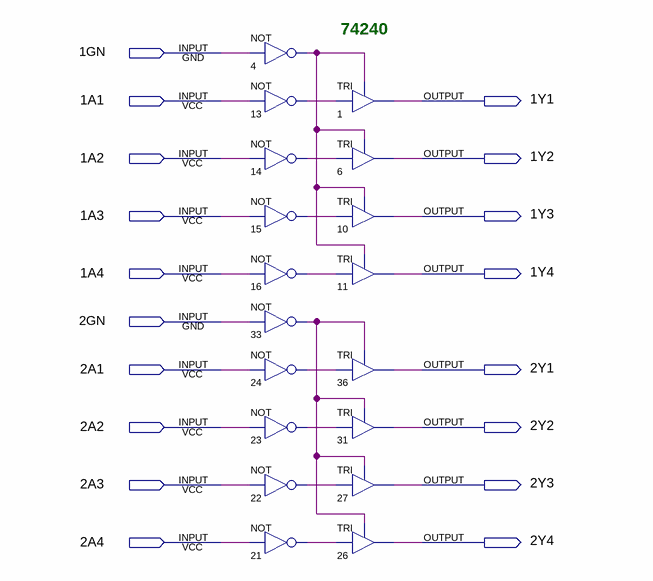
[diagram p0: schematic sheet]
// Quartus schematic 74240.bdf as structural Verilog: 18 symbols, 18 pins
module \74240  (
  input  \1GN ,
  input  \1A1 ,
  input  \1A2 ,
  input  \1A3 ,
  input  \1A4 ,
  input  \2GN ,
  input  \2A1 ,
  input  \2A2 ,
  input  \2A3 ,
  input  \2A4 ,
  output \1Y1 ,
  output \1Y2 ,
  output \1Y3 ,
  output \1Y4 ,
  output \2Y1 ,
  output \2Y2 ,
  output \2Y3 ,
  output \2Y4 
);

  wire n4_out, n13_out, n14_out, n15_out, n16_out, n21_out, n22_out, n23_out, n24_out, n33_out;

  not u_4 (n4_out, \1GN );
  not u_13 (n13_out, \1A1 );
  not u_14 (n14_out, \1A2 );
  not u_15 (n15_out, \1A3 );
  not u_16 (n16_out, \1A4 );
  not u_33 (n33_out, \2GN );
  not u_24 (n24_out, \2A1 );
  not u_23 (n23_out, \2A2 );
  not u_22 (n22_out, \2A3 );
  not u_21 (n21_out, \2A4 );
  TRI u_1 (.IN(n13_out), .OE(n4_out), .OUT(\1Y1 ));
  TRI u_6 (.IN(n14_out), .OE(n4_out), .OUT(\1Y2 ));
  TRI u_10 (.IN(n15_out), .OE(n4_out), .OUT(\1Y3 ));
  TRI u_11 (.IN(n16_out), .OE(n4_out), .OUT(\1Y4 ));
  TRI u_36 (.IN(n24_out), .OE(n33_out), .OUT(\2Y1 ));
  TRI u_31 (.IN(n23_out), .OE(n33_out), .OUT(\2Y2 ));
  TRI u_27 (.IN(n22_out), .OE(n33_out), .OUT(\2Y3 ));
  TRI u_26 (.IN(n21_out), .OE(n33_out), .OUT(\2Y4 ));

  // Notes on the sheet:
  //   74240
endmodule
